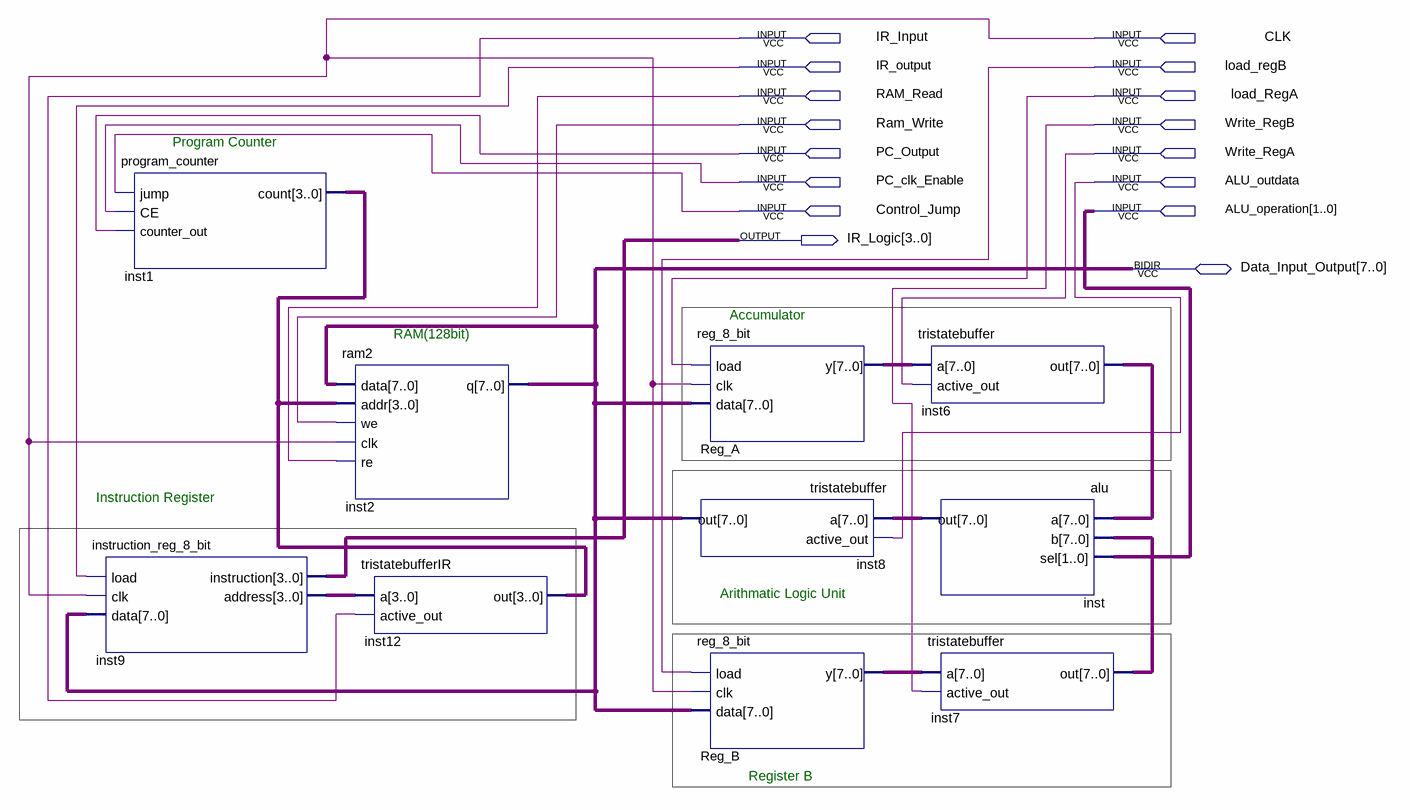
[diagram p0: schematic sheet]
// Quartus schematic 8bit_computer.bdf as structural Verilog: 10 symbols, 16 pins
module \8bit_computer  (
  input  IR_Input,
  input  CLK,
  input  IR_output,
  input  load_regB,
  input  RAM_Read,
  input  load_RegA,
  input  Ram_Write,
  input  Write_RegB,
  input  PC_Output,
  input  Write_RegA,
  input  PC_clk_Enable,
  input  ALU_outdata,
  input  Control_Jump,
  input  [1:0] ALU_operation,
  inout  [7:0] Data_Input_Output,
  output [3:0] IR_Logic
);

  wire [3:0] inst1_count, inst9_address;
  wire [7:0] inst6_out, inst7_out, inst_out, Reg_A_y, Reg_B_y;

  program_counter inst1 (.jump(Control_Jump), .CE(PC_clk_Enable), .counter_out(PC_Output), .count(inst1_count));
  instruction_reg_8_bit inst9 (
    .load(IR_output), .clk(CLK), .data(Data_Input_Output), .instruction(IR_Logic), .address(inst9_address));
  ram2 inst2 (
    .data(Data_Input_Output), .addr(inst1_count), .we(Ram_Write), .clk(CLK), .re(RAM_Read),
    .q(Data_Input_Output));
  tristatebufferIR inst12 (.a(inst9_address), .active_out(IR_Input), .out(inst1_count));
  reg_8_bit Reg_A (.load(load_RegA), .clk(CLK), .data(Data_Input_Output), .y(Reg_A_y));
  tristatebuffer inst8 (.a(inst_out), .active_out(ALU_outdata), .out(Data_Input_Output));
  reg_8_bit Reg_B (.load(load_regB), .clk(CLK), .data(Data_Input_Output), .y(Reg_B_y));
  tristatebuffer inst6 (.a(Reg_A_y), .active_out(Write_RegA), .out(inst6_out));
  alu inst (.a(inst6_out), .b(inst7_out), .sel(ALU_operation), .out(inst_out));
  tristatebuffer inst7 (.a(Reg_B_y), .active_out(Write_RegB), .out(inst7_out));

  // Notes on the sheet:
  //   Program Counter
  //   Accumulator
  //   RAM(128bit)
  //   Instruction Register
  //   Arithmatic Logic Unit
  //   Register B
endmodule
